# Altium project Hydrophones_Beaglebone_Cape.PrjPcb
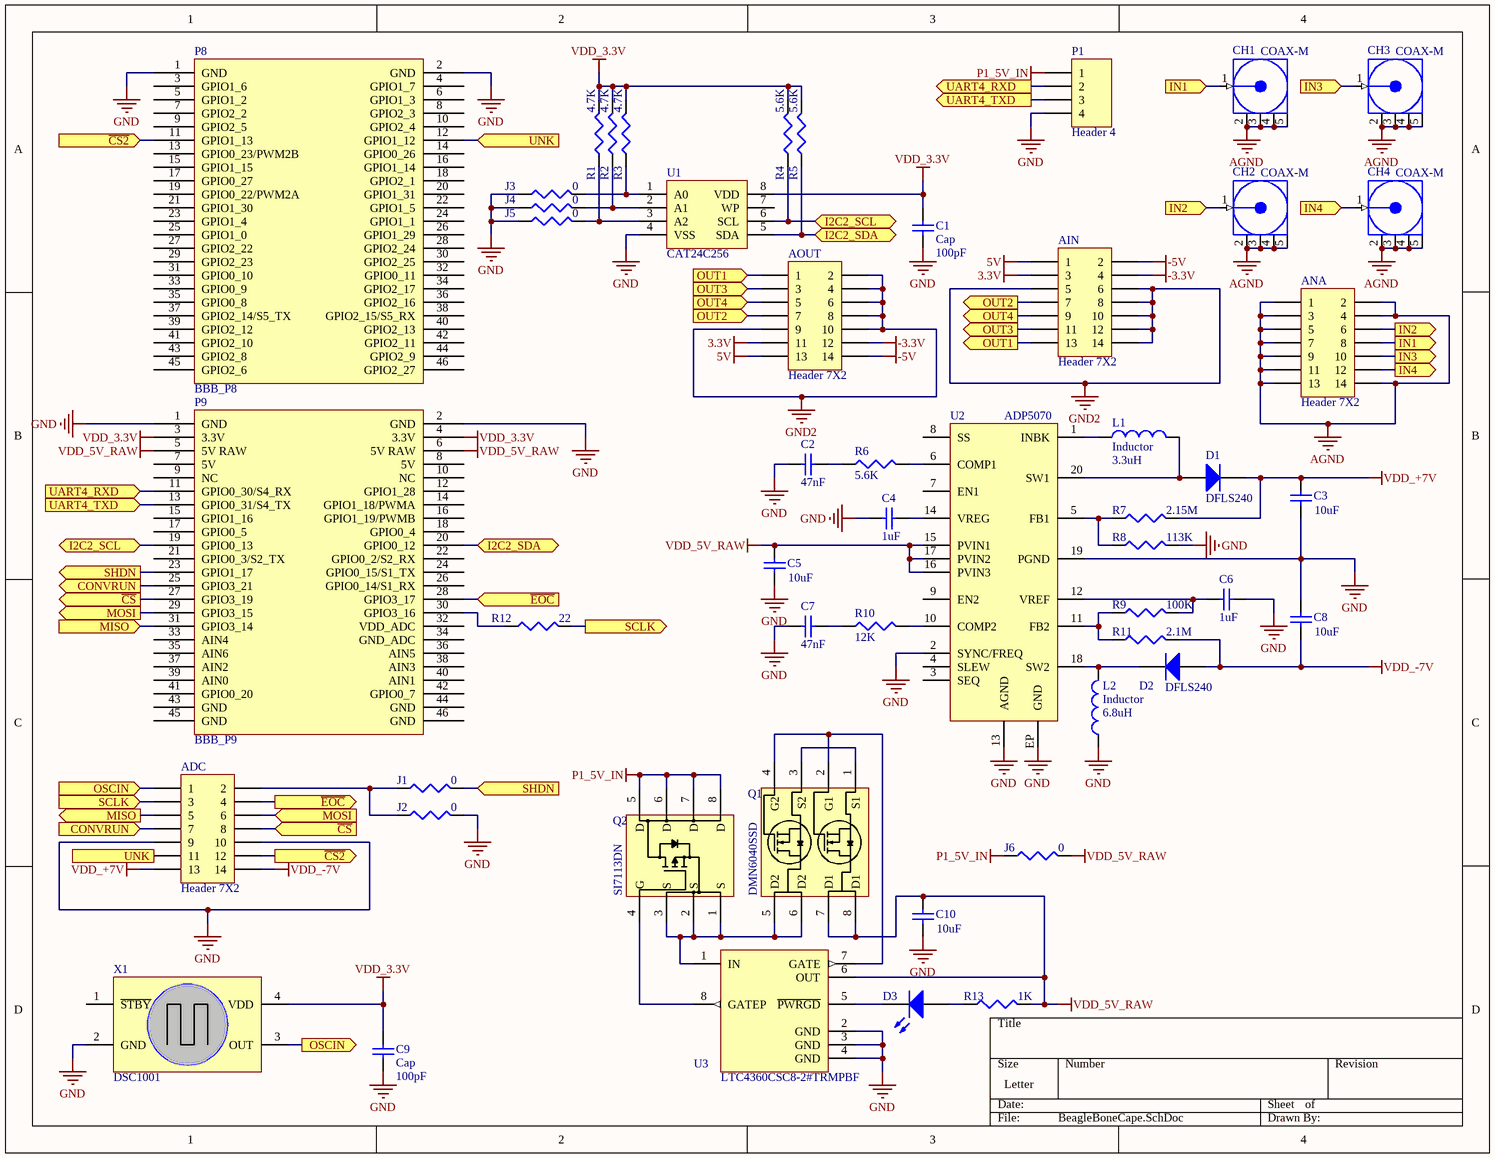
[diagram p0: BeagleBoneCape.SchDoc]
1 sheet, 51 parts. Net scope: flat (ports and power ports of the same name join across sheets).
Board file: BeagleBoneCape.PcbDoc

## Sheet BeagleBoneCape.SchDoc
size Letter

### Parts
ADC  Header 7X2  [FLE-107-01-G-DV-A-TR]
AIN  Header 7X2  [FLE-107-01-G-DV-A-TR]
ANA  Header 7X2  [FLE-107-01-G-DV-A-TR]
AOUT  Header 7X2  [FLE-107-01-G-DV-A-TR]
C1  Cap  value 100pF  [1608[0603]]
C2  value 47nF  [1608[0603]]  (hidden comment: Cap)
C3  value 10uF  [1608[0603]]  (hidden comment: Cap)
C4  value 1uF  [1608[0603]]  (hidden comment: Cap)
C5  value 10uF  [14-1210]  (hidden comment: Cap)
C6  value 1uF  [1608[0603]]  (hidden comment: Cap)
C7  value 47nF  [1608[0603]]  (hidden comment: Cap)
C8  value 10uF  [1608[0603]]  (hidden comment: Cap)
C9  Cap  value 100pF  [1608[0603]]
C10  value 10uF  [1608[0603]]  (hidden comment: Cap)
CH1  COAX-M  [MMCX-J-P-H-ST-TH1]
CH2  COAX-M  [MMCX-J-P-H-ST-TH1]
CH3  COAX-M  [MMCX-J-P-H-ST-TH1]
CH4  COAX-M  [MMCX-J-P-H-ST-TH1]
D1  DFLS240  [DFLS240]
D2  DFLS240  [DFLS240]
D3  LED2  [1608[0603]]  (value not drawn)
J1  value 0  [J1-0603]  (hidden comment: Res3)
J2  value 0  [J1-0603]  (hidden comment: Res3)
J3  value 0  [J1-0603]  (hidden comment: Res3)
J4  value 0  [J1-0603]  (hidden comment: Res3)
J5  value 0  [J1-0603]  (hidden comment: Res3)
J6  value 0  [14-1210]  (hidden comment: Res3)
L1  Inductor  value 3.3uH  [SMD_41_41_21]
L2  Inductor  value 6.8uH  [SMD_41_41_31]
P1  Header 4  [0705530038]
P8  BBB_P8  [BBB_CAPE_HEADER]
P9  BBB_P9  [BBB_CAPE_HEADER]
Q1  DMN6040SSD  [SOIC-8]
Q2  SI7113DN  [PowerPAK1212-8]
R1  value 4.7K  [J1-0603]  (hidden comment: Res3)
R2  value 4.7K  [J1-0603]  (hidden comment: Res3)
R3  value 4.7K  [J1-0603]  (hidden comment: Res3)
R4  value 5.6K  [J1-0603]  (hidden comment: Res3)
R5  value 5.6K  [J1-0603]  (hidden comment: Res3)
R6  value 5.6K  [J1-0603]  (hidden comment: Res3)
R7  value 2.15M  [J1-0603]  (hidden comment: Res3)
R8  value 113K  [J1-0603]  (hidden comment: Res3)
R9  value 100K  [J1-0603]  (hidden comment: Res3)
R10  value 12K  [J1-0603]  (hidden comment: Res3)
R11  value 2.1M  [J1-0603]  (hidden comment: Res3)
R12  value 22  [J1-0603]  (hidden comment: Res3)
R13  value 1K  [J1-0603]  (hidden comment: Res3)
U1  CAT24C256  [SOIC-8]
U2  ADP5070  [QFN50P400X400X80_HS-21N]
U3  LTC4360CSC8-2#TRMPBF  [LT-SC8-8-SC70_N]
X1  DSC1001  [DSC1001]

### Ports
CONVRUN (in), CONVRUN (out), I2C2_SCL (bidir), I2C2_SDA (bidir), IN1 (in), IN1 (out), IN2 (in), IN2 (out), IN3 (in), IN3 (out), IN4 (in), IN4 (out), MISO (in), MISO (out), MOSI (in), MOSI (out), OSCIN (in), OSCIN (out), OUT1 (in), OUT1 (out), OUT2 (in), OUT2 (out), OUT3 (in), OUT3 (out), OUT4 (in), OUT4 (out), SCLK (in), SCLK (out), SHDN (in), SHDN (out), UART4_RXD (in), UART4_RXD (out), UART4_TXD (in), UART4_TXD (out), UNK (in), UNK (out), ~{CS2} (in), ~{CS2} (out), ~{CS} (in), ~{CS} (out), ~{EOC} (in), ~{EOC} (out)

### Nets
3.3V: AIN.3 AOUT.11
5V: AIN.1 AOUT.13
-3.3V: AIN.4 AOUT.12
-5V: AIN.2 AOUT.14
AGND: ANA.1 ANA.2 ANA.3 ANA.4 ANA.5 ANA.7 ANA.9 ANA.11 ANA.13 ANA.14 CH1.2(GND) CH1.3(GND) CH1.4(GND) CH1.5(GND) CH2.2(GND) CH2.3(GND) CH2.4(GND) CH2.5(GND) CH3.2(GND) CH3.3(GND) CH3.4(GND) CH3.5(GND) CH4.2(GND) CH4.3(GND) CH4.4(GND) CH4.5(GND)
GND: ADC.9 ADC.10 C1.1 C2.2 C3.1 C4.2 C5.1 C6.1 C7.2 C8.2 C9.1 C10.1 J2.2 J3.1 J4.1 J5.1 L2.1 P1.4 P8.1(GND) P8.2(GND) P9.1(GND) P9.2(GND) R8.2 U1.4(VSS) U2.2(SYNC/FREQ) U2.13(AGND) U2.19(PGND) U2.EP(GND) U3.2(GND) U3.3(GND) U3.4(GND) X1.2(GND)
GND2: AIN.5 AIN.6 AIN.8 AIN.10 AIN.12 AIN.14 AOUT.2 AOUT.4 AOUT.6 AOUT.8 AOUT.9 AOUT.10
P1_5V_IN: J6.1 P1.1 Q2.5(D) Q2.6(D) Q2.7(D) Q2.8(D)
VDD_3.3V: C1.2 C9.2 P9.3(3.3V) P9.4(3.3V) R1.2 R2.2 R3.2 R4.2 R5.2 U1.8(VDD) X1.4(VDD)
VDD_5V_RAW: C5.2 C10.2 J6.2 P9.5(5V_RAW) P9.6(5V_RAW) Q1.7(D1) Q1.8(D1) R13.2 U2.15(PVIN1) U2.16(PVIN3) U2.17(PVIN2) U3.6(OUT)
VDD_+7V: ADC.13 C3.2 D1.2(K) R7.2
VDD_-7V: ADC.14 C8.1 D2.1(A) R11.2
NetADC_1: ADC.1 X1.3(OUT) ; port OSCIN
NetADC_2: ADC.2 J1.1 J2.1
NetADC_3: ADC.3 R12.2 ; port SCLK
NetADC_4: ADC.4 P9.28(GPIO3_17) ; port ~{EOC}
NetADC_5: ADC.5 P9.31(GPIO3_14) ; port MISO
NetADC_6: ADC.6 P9.29(GPIO3_15) ; port MOSI
NetADC_7: ADC.7 P9.25(GPIO3_21) ; port CONVRUN
NetADC_8: ADC.8 P9.27(GPIO3_19) ; port ~{CS}
NetADC_11: ADC.11 P8.12(GPIO1_12) ; port UNK
NetADC_12: ADC.12 P8.11(GPIO1_13) ; port ~{CS2}
NetAIN_7: AIN.7 AOUT.7 ; port OUT2
NetAIN_9: AIN.9 AOUT.5 ; port OUT4
NetAIN_11: AIN.11 AOUT.3 ; port OUT3
NetAIN_13: AIN.13 AOUT.1 ; port OUT1
NetANA_6: ANA.6 CH2.1(Signal) ; port IN2
NetANA_8: ANA.8 CH1.1(Signal) ; port IN1
NetANA_10: ANA.10 CH3.1(Signal) ; port IN3
NetANA_12: ANA.12 CH4.1(Signal) ; port IN4
NetC2_1: C2.1 R6.1
NetC4_1: C4.1 U2.14(VREG)
NetC6_2: C6.2 R9.2 U2.12(VREF)
NetC7_1: C7.1 R10.1
NetD1_1: D1.1(A) L1.2 U2.20(SW1)
NetD2_2: D2.2(K) L2.2 U2.18(SW2)
NetD3_1: D3.1(A) R13.1
NetD3_2: D3.2(K) U3.5(~{PWRGD})
NetJ1_2: J1.2 P9.23(GPIO1_17) ; port SHDN
NetJ3_2: J3.2 R3.1 U1.1(A0)
NetJ4_2: J4.2 R2.1 U1.2(A1)
NetJ5_2: J5.2 R1.1 U1.3(A2)
NetL1_1: L1.1 U2.1(INBK)
NetP1_2: P1.2 P9.11(GPIO0_30/S4_RX) ; port UART4_RXD
NetP1_3: P1.3 P9.13(GPIO0_31/S4_TX) ; port UART4_TXD
NetP9_19: P9.19(GPIO0_13) R4.1 U1.6(SCL) ; port I2C2_SCL
NetP9_20: P9.20(GPIO0_12) R5.1 U1.5(SDA) ; port I2C2_SDA
NetP9_30: P9.30(GPIO3_16) R12.1
NetQ1_1: Q1.1(S1) Q1.3(S2)
NetQ1_2: Q1.2(G1) Q1.4(G2) U3.7(GATE)
NetQ1_5: Q1.5(D2) Q1.6(D2) Q2.1(S) Q2.2(S) Q2.3(S) U3.1(IN)
NetQ2_4: Q2.4(G) U3.8(GATEP)
NetR6_2: R6.2 U2.6(COMP1)
NetR7_1: R7.1 R8.1 U2.5(FB1)
NetR9_1: R9.1 R11.1 U2.11(FB2)
NetR10_2: R10.2 U2.10(COMP2)

Not connected (* = marked no-connect by the designer): P8 3(GPIO1_6) 4(GPIO1_7) 5(GPIO1_2) 6(GPIO1_3) 7(GPIO2_2) 8(GPIO2_3) 9(GPIO2_5) 10(GPIO2_4) 13(GPIO0_23/PWM2B) 14(GPIO0_26) 15(GPIO1_15) 16(GPIO1_14) 17(GPIO0_27) 18(GPIO2_1) 19(GPIO0_22/PWM2A) 20(GPIO1_31) 21(GPIO1_30) 22(GPIO1_5) 23(GPIO1_4) 24(GPIO1_1) 25(GPIO1_0) 26(GPIO1_29) 27(GPIO2_22) 28(GPIO2_24) 29(GPIO2_23) 30(GPIO2_25) 31(GPIO0_10) 32(GPIO0_11) 33(GPIO0_9) 34(GPIO2_17) 35(GPIO0_8) 36(GPIO2_16) 37(GPIO2_14/S5_TX) 38(GPIO2_15/S5_RX) 39(GPIO2_12) 40(GPIO2_13) 41(GPIO2_10) 42(GPIO2_11) 43(GPIO2_8) 44(GPIO2_9) 45(GPIO2_6) 46(GPIO2_27); P9 7(5V) 8(5V) 9(NC) 10(NC) 12(GPIO1_28) 14(GPIO1_18/PWMA) 15(GPIO1_16) 16(GPIO1_19/PWMB) 17(GPIO0_5) 18(GPIO0_4) 21(GPIO0_3/S2_TX) 22(GPIO0_2/S2_RX) 24(GPIO0_15/S1_TX) 26(GPIO0_14/S1_RX) 32(VDD_ADC) 33(AIN4) 34(GND_ADC) 35(AIN6) 36(AIN5) 37(AIN2) 38(AIN3) 39(AIN0) 40(AIN1) 41(GPIO0_20) 42(GPIO0_7) 43(GND) 44(GND) 45(GND) 46(GND); U1 7(WP); U2 3(SEQ) 4(SLEW) 7(EN1) 8(SS) 9(EN2); X1 1(~{STBY})

### Library data of the parts
ADC AIN ANA AOUT = Header 7X2: Header, 7-Pin, Dual row; LatestRevisionDate: 17-Jul-2002; LatestRevisionNote: Re-released for DXP Platform.; Publisher: Altium Limited
C1-C10 = Cap: Capacitor; Published: 8-Jun-2000; LatestRevisionDate: 17-Jul-2002; LatestRevisionNote: Re-released for DXP Platform.; PackageReference: RAD-0.3; Publisher: Altium Limited; PackageDescription: Radial Cap, Thru-Hole; 2 Leads; 0.3 in Pin Spacing
CH1-CH4 = COAX-M: RF Coaxial PCB Connector, MMCX; Thru-Hole, Vertical Mount Plug,  50 Ohm Impedance; PackageDocument: Rev. A, 16-Jun-1997; PCB_Layout: Complies with manufacturer's recommendation.; DrillSize: Corresponds to nominal value.; Published: 15-Jul-2004; LatestRevisionDate: 15-Jul-2004; LatestRevisionNote: Component Replaced.; DatasheetDocument: 30-May-2003; PackageReference: 908-21103; Publisher: Altium Limited; ComponentLink1Description: Manufacturer Link; ComponentLink1URL: http://www.amphenolrf.com/
D1 D2 = Diode: Default Diode; Published: 8-Jun-2000; LatestRevisionDate: 17-Jul-2002; LatestRevisionNote: Re-released for DXP Platform.; PackageVersion: Sep-1996; PackageReference: SMC; Publisher: Altium Limited; PackageDescription: DO-214-AB/SMC; 2 C-Bend Leads; Body 7.9 x 5.9 mm, inc. leads (LxW); Code_JEDEC: DO-214-AB
D3 = LED2: Typical RED, GREEN, YELLOW, AMBER GaAs LED; Published: 8-Jun-2000; LatestRevisionDate: 17-Jul-2002; LatestRevisionNote: Re-released for DXP Platform.; PackageVersion: Feb-2002; PackageReference: 3.2X1.6X1.1; Publisher: Altium Limited; PackageDescription: SM LED; 2 Flat Leads
J1-J6 R1-R13 = Res3: Resistor; Published: 8-Jun-2000; LatestRevisionDate: 29-May-2009; LatestRevisionNote: IPC-7351 Footprint Added.; PackageReference: J1-0603; Publisher: Altium Limited; PackageDescription: Chip Resistor
L1 L2 = Inductor: Code_IEC: 1005; Published: 8-Jun-2000; LatestRevisionDate: 29-May-2009; LatestRevisionNote: IPC-7351 Footprint Added.; PackageReference: 0402-A; Publisher: Altium Limited; PackageDescription: Chip Inductor; Code_JEITA: 0402
P1 = Header 4: Header, 4-Pin; LatestRevisionDate: 17-Jul-2002; LatestRevisionNote: Re-released for DXP Platform.; Publisher: Altium Limited
U3 = LTC4360CSC8-2#TRMPBF: Overvoltage Protection Controller, 2.5 to 80 V Vin, 8-pin SOT23 (SC8-8), 0 to 70 degC, Pb-Free, Mini Tape and Reel; Manufacturer: Linear Technology; Active Limiting: no; Circuit Breakers(#): 1; Extended Temp: C, I; Power Good: yes; DatasheetVersion: Rev. A; PackageVersion: Rev. Ø, 06/2012; PackageReference: SC8-8; PackageDescription: 8-Pin Plastic SC70, Body 2 x 1.25 mm, Pitch 0.5 mm; Supplier 1: Digi-Key; Supplier Part Number 1: LTC4360CSC8-2#TRMPBFTR-ND; Supplier 2: Digi-Key; Supplier Part Number 2: LTC4360CSC8-2#TRMPBFCT-ND; Supplier 3: Digi-Key; Supplier Part Number 3: LTC4360CSC8-2#TRMPBFDKR-ND; Supplier 4: Farnell; Supplier Part Number 4: 1839108; Fast Comparator: no; Fault: no; Foldback: no; Packing: Mini Tape and Reel; Reset: no; RoHS: TRUE; Vin Range: 2.5 to 80 V; Mounting Technology: Surface Mount; Code_JEDEC: MO-203; PartNumber: LTC4360CSC8-2#TRMPBF; ComponentLink1Description: Manufacturer URL; ComponentLink1URL: http://www.linear.com/; ComponentLink2Description: Datasheet; ComponentLink2URL: http://cds.linear.com/docs/en/datasheet/436012fa.pdf; ComponentLink3Description: Package Specification; ComponentLink3URL: http://cds.linear.com/docs/en/packaging/SOT_8_05-08-1639.pdf